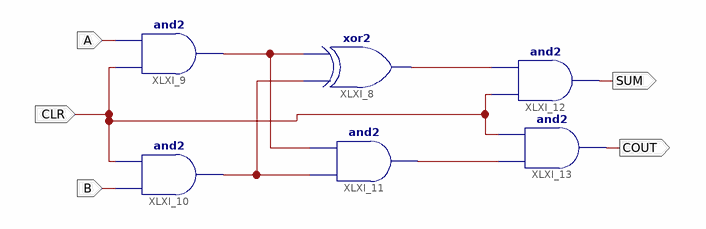
[diagram p0: schematic sheet 1]
// Xilinx ISE schematic HA_Clear.sch (artix7) as structural Verilog: 6 symbols, 5 ports
module HA_Clear (
  input  CLR,
  input  A,
  input  B,
  output SUM,
  output COUT
);

  wire XLXN_10, XLXN_11, XLXN_17, XLXN_20;

  and XLXI_9 (XLXN_10, CLR, A);
  and XLXI_10 (XLXN_11, B, CLR);
  xor XLXI_8 (XLXN_17, XLXN_11, XLXN_10);
  and XLXI_11 (XLXN_20, XLXN_11, XLXN_10);
  and XLXI_12 (SUM, CLR, XLXN_17);
  and XLXI_13 (COUT, XLXN_20, CLR);
endmodule
